# EAGLE design receiver (EAGLE 7.1.0)
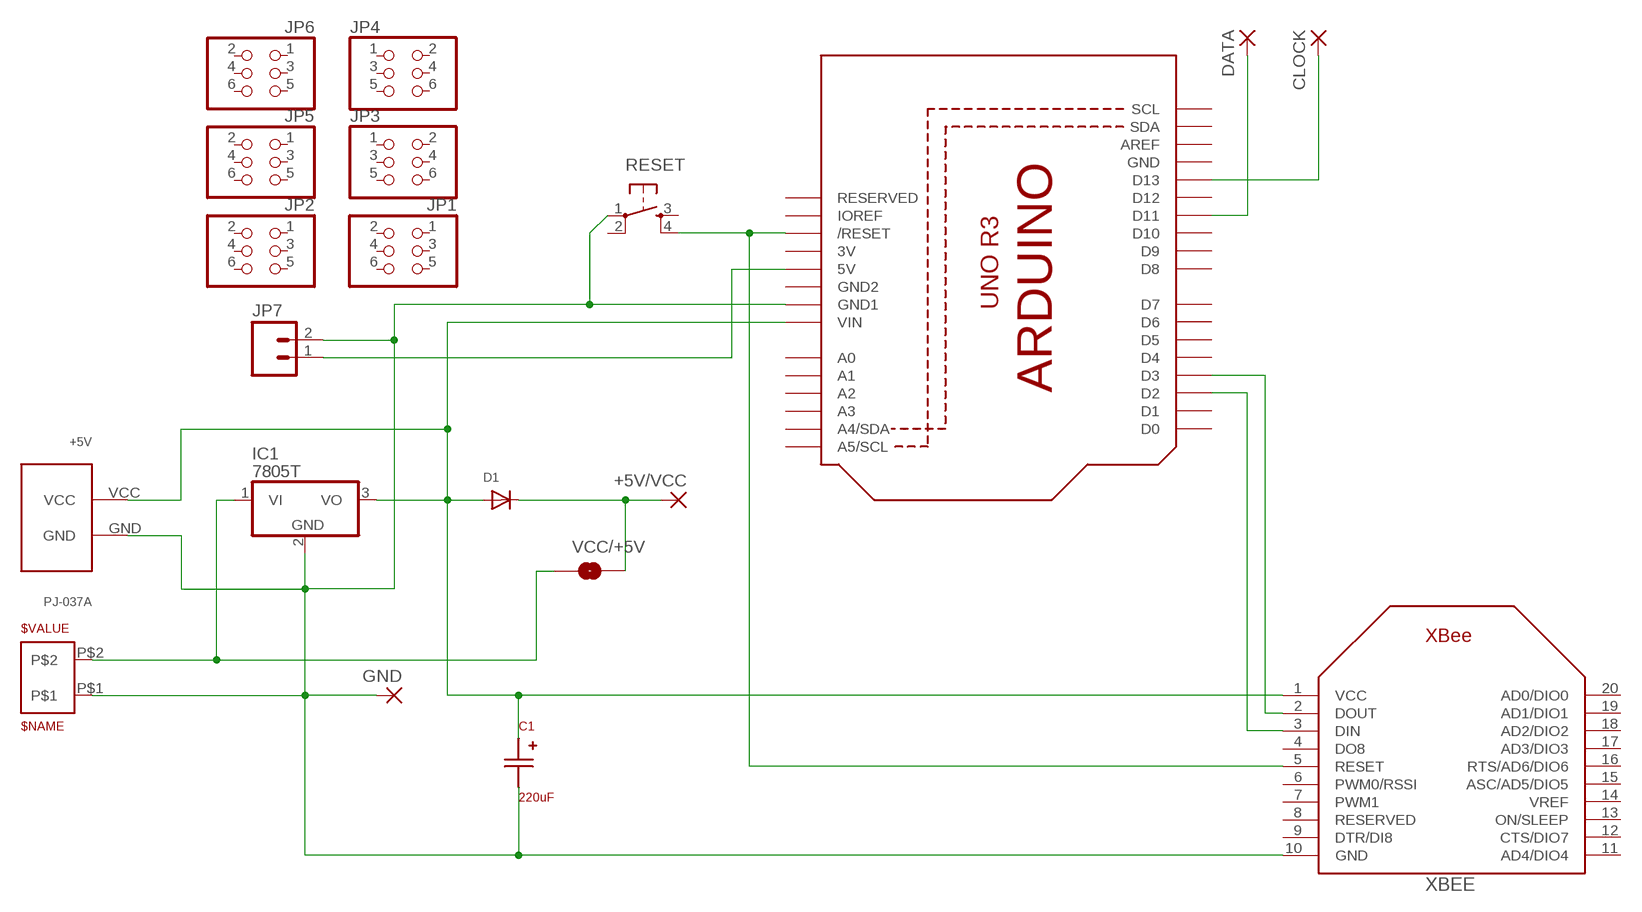
[diagram p0: schematic, sheet 1]

## Parts
+5V  PJ-037A  [PJ-037A]
+5V/VCC  2,15/1,0  [2,15/1,0]
C1  220uF  UWT0J221MCL1GB  [UWT0J221MCL1GB]
CLOCK  2,15/1,0  [2,15/1,0]
D1  DIODESOD-323F  [SOD-323F]
DATA  2,15/1,0  [2,15/1,0]
GND  2,15/1,0  [2,15/1,0]
IC1  7805T  [TO220H]
JP1  PINHD-2X3  [2X03]
JP2  PINHD-2X3  [2X03]
JP3  PINHD-2X3  [2X03]
JP4  PINHD-2X3  [2X03]
JP5  PINHD-2X3  [2X03]
JP6  PINHD-2X3  [2X03]
JP7  M02PTH  [1X02]
RESET  TAC_SWITCHSMD  [TACTILE_SWITCH_SMD]
U1  ARDUINOR3-DIMENSION  [ARDUINOR3]
VCC  OSTOQ023251  [OSTOQ023251]
VCC/+5V  NC=+5v  SOLDERJUMPERNO  [SJ_2S-NO]
XBEE  XBEE  [XBEE]

## Nets
GND: +5V.GND C1.- GND.1(P) IC1.2(GND) JP7.2 RESET.1 U1.GND1 VCC.P$1 XBEE.10(GND)
N$1: IC1.1(VI) VCC.P$2 VCC/+5V.1
N$2: DATA.1(P) U1.D11
N$3: CLOCK.1(P) U1.D13
N$4: RESET.4 U1.RESET(/RESET) XBEE.5(RESET)
N$5: U1.D2 XBEE.3(DIN)
N$6: U1.D3 XBEE.2(DOUT)
N$7: JP7.1 U1.5V
N$8: +5V/VCC.1(P) D1.C VCC/+5V.2
VCC: +5V.VCC C1.+ D1.A IC1.3(VO) U1.VIN XBEE.1(VCC)
Unconnected: JP1.1 JP1.2 JP1.3 JP1.4 JP1.5 JP1.6 JP2.1 JP2.2 JP2.3 JP2.4 JP2.5 JP2.6 JP3.1 JP3.2 JP3.3 JP3.4 JP3.5 JP3.6 JP4.1 JP4.2 JP4.3 JP4.4 JP4.5 JP4.6 JP5.1 JP5.2 JP5.3 JP5.4 JP5.5 JP5.6 JP6.1 JP6.2 JP6.3 JP6.4 JP6.5 JP6.6 RESET.2 RESET.3 U1.A0 U1.A1 U1.A2 U1.A3 U1.A4(A4/SDA) U1.A5(A5/SCL) U1.AREF U1.D0 U1.D1 U1.D4 U1.D5 U1.D6 U1.D7 U1.D8 U1.D9 U1.D10 U1.D12 U1.IOREF U1.RESERVED U1.SCL U1.SDA XBEE.4(DO8) XBEE.6(PWM0/RSSI) XBEE.7(PWM1) XBEE.8(RESERVED) XBEE.9(DTR/DI8) XBEE.11(AD4/DIO4) XBEE.12(CTS/DIO7) XBEE.13(ON/SLEEP) XBEE.14(VREF) XBEE.15(ASC/AD5/DIO5) XBEE.16(RTS/AD6/DIO6) XBEE.17(AD3/DIO3) XBEE.18(AD2/DIO2) XBEE.19(AD1/DIO1) XBEE.20(AD0/DIO0)

## Power pins joined to a net without a drawn wire
3V: U1.3V
GND: U1.GND
GND2: U1.GND2

## Library data of the parts
+5V = phrobo:PJ-037A
+5V/VCC CLOCK DATA GND = wirepad:2,15/1,0: THROUGH-HOLE PAD
C1 = phrobo:UWT0J221MCL1GB
D1 = adafruit:DIODE: Diode SMADIODE - SMA Surface Mount Package 20V 1A Schottky Diode Digikey: 641-1014-6-ND DO-1N4148 - Through Hole Small Current Diode SOD-123 20V 1 A (.5mV Vf) Schottky Diode - Digikey: MBRX120TPMSCT-ND SOD-323 10V 570mA (.38mV Vf, 3ns) Schottky Diode - Digikey: ZLLS410CT-ND SOD-523 30V 30mA Schottky Diode (RB751S-40TE61) - Digikey: RB751S-40TE61CT-ND SOT23-R/W - SOT23 Package (R = Solder Paste/Reflow Ovens, W = Hand-Soldering) BAT54Film 40V 300mA - Digikey: 497-7162-1-ND
IC1 = adafruit:78*: Positive VOLTAGE REGULATOR Added bigger pads to the TO-92 package
JP1-JP6 = SparkFun:PINHD-2X3: PIN HEADER
JP7 = SparkFun:M02: Header 2 Standard 2-pin 0.1" header. Use with straight break away headers (SKU : PRT-00116), right angle break away headers (PRT-00553), swiss pins (PRT-00743), machine pins (PRT-00117), and female headers (PRT-00115). Molex polarized connector foot print use with SKU : PRT-08233 with associated crimp pins and housings.
RESET = SparkFun:TAC_SWITCH: Momentary Switch Button commonly used for reset or general input. Spark Fun Electronics SKU : COM-00097
U1 = adafruit:ARDUINOR3: This is a new object for the new Arduino R3 - with extra pins that you may want to use (such as IOref, and duplicated A4/A5
VCC = phrobo:OSTOQ023251
VCC/+5V = SparkFun:SOLDERJUMPER: Solder Jumper Standard SMD solder jumper. Used to automate production. Two varients : Normally Open and Normally Closed are the same, but have different paste layers. NC will have a large amount of paste and should jumper during reflow.
XBEE = adafruit:XBEE

## Board
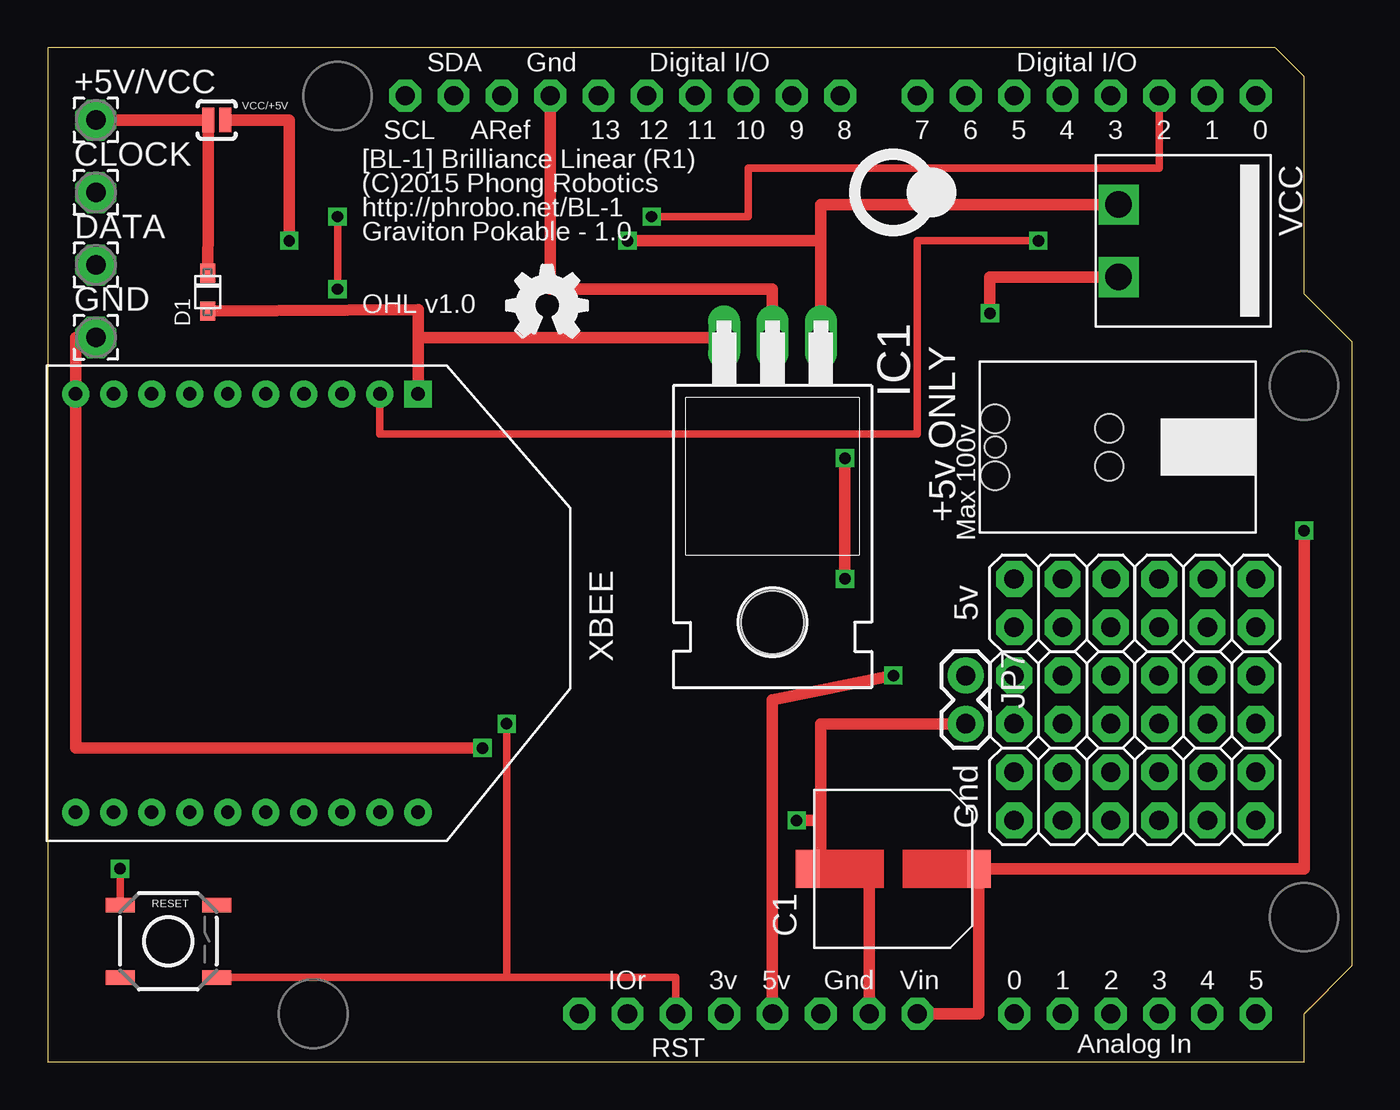
[diagram p1: board, top side]
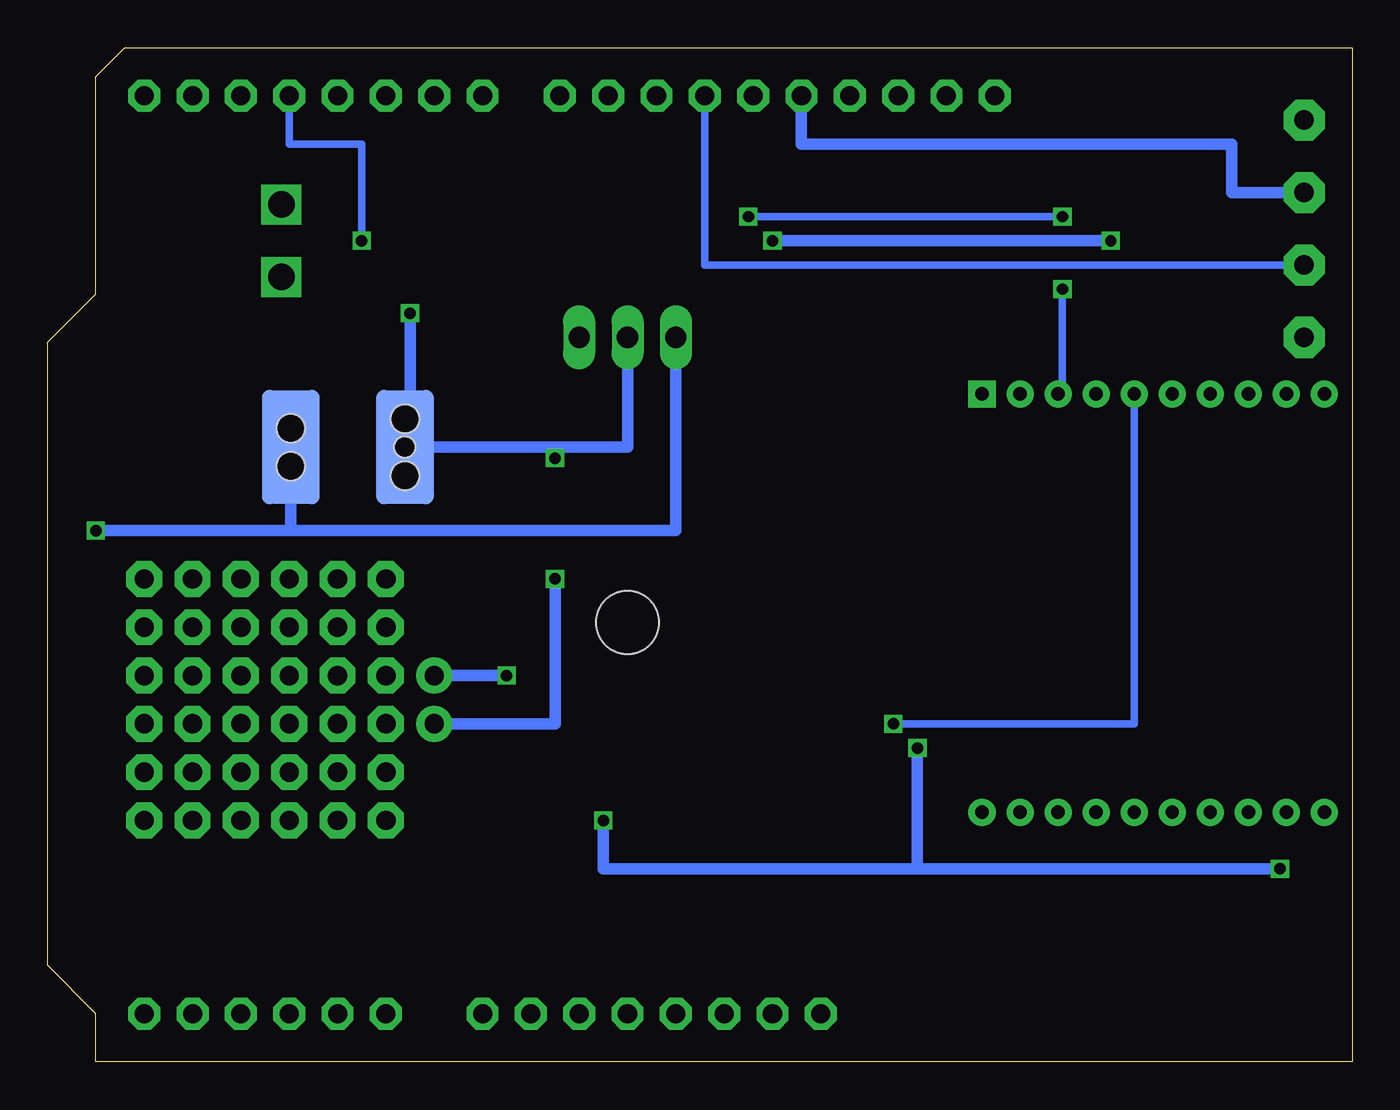
[diagram p2: board, bottom side, seen from below]

Size 68.58 x 53.34 mm. Coordinates in mm from the lower left corner, seen from the top.
Copper layers (1*16): Top 0.0356mm / dielectric 1.5011mm / Bottom 0.0356mm
Design rules "LaenPCBOrder": minimum track width 6mil, minimum drill 13mil, track to track 6mil, track to pad 6mil, pad to pad 6mil, via to via 6mil, smd to smd 6mil, copper to edge 15mil, drill to drill 6mil, minimum pad ring 7mil, minimum via ring 7mil, stop-mask expansion 3mil, vias tented up to drill 0mil, thermal gap 10mil

### Footprints (pad centres in the part's own frame; a part is rotated, then mirrored left to right if it is on the bottom)
PJ-037A = smd 3 x 6 bottom: GND 13.7,4.5; VCC 7.7,4.5 | hole 1.5: 7.7,3.5; 13.7,6; 7.7,5.5; 13.7,3 | hole 1.1: 13.7,4.5
2,15/1,0 = drill 1.016 pad 2.159 octagon: 1 0,0
UWT0J221MCL1GB = smd 2 x 1.25: + 0,4.5; - 0,-4.5
SOD-323F = smd 1 x 0.8: A -1,0; C 1,0
TO220H = drill 1.118 long: 1 -2.54,-10.16; 2 0,-10.16; 3 2.54,-10.16 | hole 3.302: 0,4.826
2X03 = drill 1.016 pad 1.88 octagon: 1 -2.54,-1.27; 2 -2.54,1.27; 3 0,-1.27; 4 0,1.27; 5 2.54,-1.27; 6 2.54,1.27
1X02 = drill 1.016 pad 1.88: 1 0,0; 2 2.54,0
TACTILE_SWITCH_SMD = smd 1.524 x 0.762: 1 -2.54,1.905; 2 2.54,1.905; 3 -2.54,-1.905; 4 2.54,-1.905
ARDUINOR3 = drill 1 pad 1.676 octagon: 3V 35.56,2.54; 5V 38.1,2.54; A0 50.8,2.54; A1 53.34,2.54; A2 55.88,2.54; A3 58.42,2.54; A4 60.96,2.54; A5 63.5,2.54; AREF 23.876,50.8; D0 63.5,50.8; D1 60.96,50.8; D2 58.42,50.8; D3 55.88,50.8; D4 53.34,50.8; D5 50.8,50.8; D6 48.26,50.8; D7 45.72,50.8; D8 41.656,50.8; D9 39.116,50.8; D10 36.576,50.8; D11 34.036,50.8; D12 31.496,50.8; D13 28.956,50.8; GND 26.416,50.8; GND1 43.18,2.54; GND2 40.64,2.54; IOREF 30.48,2.54; RESERVED 27.94,2.54; RESET 33.02,2.54; SCL 18.796,50.8; SDA 21.336,50.8; VIN 45.72,2.54
OSTOQ023251 = drill 1.4 square: P$1 1.905,-3.4; P$2 -1.905,-3.4
SJ_2S-NO = smd 0.635 x 1.27: 1 -0.45,0; 2 0.45,0
XBEE = drill 0.7 pad 1.422 square: 1 -11,5.5 | drill 0.7 pad 1.422: 2 -11,3.5; 3 -11,1.5; 4 -11,-0.5; 5 -11,-2.5; 6 -11,-4.5; 7 -11,-6.5; 8 -11,-8.5; 9 -11,-10.5; 10 -11,-12.5; 11 11,-12.5; 12 11,-10.5; 13 11,-8.5; 14 11,-6.5; 15 11,-4.5; 16 11,-2.5; 17 11,-0.5; 18 11,1.5; 19 11,3.5; 20 11,5.5

### Placement (x,y rotation side)
+5V  63.5,36.83 180 top
+5V/VCC  2.54,49.53 0 top
C1  44.45,10.16 270 top
CLOCK  2.54,45.72 0 top
D1  8.41,40.48 90 top
DATA  2.54,41.91 0 top
GND  2.54,38.1 0 top
IC1  38.1,27.94 180 top
JP1  60.96,13.97 0 top
JP2  53.34,13.97 0 top
JP3  60.96,24.13 0 top
JP4  53.34,24.13 0 top
JP5  60.96,19.05 0 top
JP6  53.34,19.05 0 top
JP7  48.26,20.32 270 top
RESET  6.35,6.35 0 top
U1  0,0 0 top
U$4  [PHROBO-LOGO]  44.45,45.72 0 top
U$5  [OSHW_FILLX150_NOTEXT]  24.13,38.1 0 top
VCC  59.69,43.18 270 top
VCC/+5V  8.89,49.53 180 top
XBEE  13.97,24.13 270 top

### Tracks (layer width: path | path; a pad name or v marks a point on that pad's centre or on a via)
GND  (via drill 0.6)
  Top 0.406: 43.18,10.16 40.64,10.16 C1.- | RESET.1 v3.81,10.16 | 1.47,38.1 GND.1
  Top 0.61: U1.GND1 43.18,10.16 | JP7.2 40.64,17.78 40.64,12.7 | 40.64,12.7 40.64,10.16 | v39.37,12.7 40.64,12.7 | 1.47,38.1 XBEE.10 1.47,16.51 v22.86,16.51 | VCC.P$1 49.53,41.27 v49.53,39.37 | v41.91,25.4 v41.91,31.75 | U1.GND 26.42,40.64 38.1,40.64 IC1.2
  Bottom 0.406: 49.53,32.33 +5V.GND | 41.91,32.33 v41.91,31.75
  Bottom 0.61: v3.81,10.16 22.86,10.16 | 22.86,10.16 39.37,10.16 v39.37,12.7 | v22.86,16.51 22.86,10.16 | v49.53,39.37 49.53,32.33 | +5V.GND 41.91,32.33 38.1,32.33 IC1.2 | JP7.2 41.91,17.78 v41.91,25.4
N$1  (via drill 0.6)
  Top 0.61: IC1.1 40.64,43.18 | 40.64,43.18 40.64,45.08 VCC.P$2 | VCC/+5V.1 12.7,49.53 v12.7,43.18 | v30.48,43.18 40.64,43.18
  Bottom 0.61: v12.7,43.18 v30.48,43.18
N$2
  Bottom 0.406: DATA.1 34.04,41.91 U1.D11
N$3
  Bottom 0.61: CLOCK.1 6.35,45.72 6.35,48.26 28.96,48.26 U1.D13
N$4  (via drill 0.6)
  Top 0.406: U1.RESET 33.02,4.45 24.13,4.45 | 24.13,4.45 RESET.4 | v24.13,17.78 24.13,4.45
  Bottom 0.406: XBEE.5 11.47,17.78 v24.13,17.78
N$5  (via drill 0.6)
  Top 0.406: v15.24,40.64 v15.24,44.45 | v31.75,44.45 36.83,44.45 36.83,46.99 58.42,46.99 U1.D2
  Bottom 0.406: XBEE.3 15.24,35.13 v15.24,40.64 | v15.24,44.45 v31.75,44.45
N$6  (via drill 0.6)
  Top 0.406: XBEE.2 17.47,33.02 45.72,33.02 45.72,43.18 v52.07,43.18
  Bottom 0.406: v52.07,43.18 52.07,48.26 55.88,48.26 U1.D3
N$7  (via drill 0.6)
  Top 0.61: v44.45,20.32 38.1,19.05 U1.5V
  Bottom 0.61: JP7.1 v44.45,20.32
N$8
  Top 0.61: +5V/VCC.1 VCC/+5V.2 8.44,44.26 D1.C
VCC  (via drill 0.6)
  Top 0.61: D1.A 19.47,39.56 19.47,38.1 | 19.47,38.1 XBEE.1 | IC1.3 19.47,38.1 | U1.VIN 48.95,2.54 C1.+ 66.04,10.16 v66.04,27.94
  Bottom 0.61: +5V.VCC 55.8,27.94 | 55.8,27.94 35.56,27.94 IC1.3 | v66.04,27.94 55.8,27.94

### Text on the board
tPlace: Max 100v
tNames: [BL-1] Brilliance Linear (R1) | (C)2015 Phong Robotics | http://phrobo.net/BL-1 | Graviton Pokable - 1.0 | OHL v1.0 | +5v ONLY | 5v | Gnd